# Altium schematic sheet Voltage_sensor.SchDoc
size B; SheetNumber: 5; SheetTotal: 6; SPICEModelCacheSCQTRBCW: <root> / <DocumentId>SCQTRBCW</DocumentId> / <CacheFrame Number="0"> / <Model Name="cap" Kind="MDL"> / <Text>*Default semiconductor capacitor / .MODEL CAP C()</Text> / </Model> / <Model Name="zener" Kind="MDL"> / <Text>*ZENER / *Default Zener 10V @ 10mA / *Zener Diode Pinout: A,K / .MODEL ZENER D( BV=10 IBV=10E-3 )</Text> / </Model> / </CacheFrame> / </root>
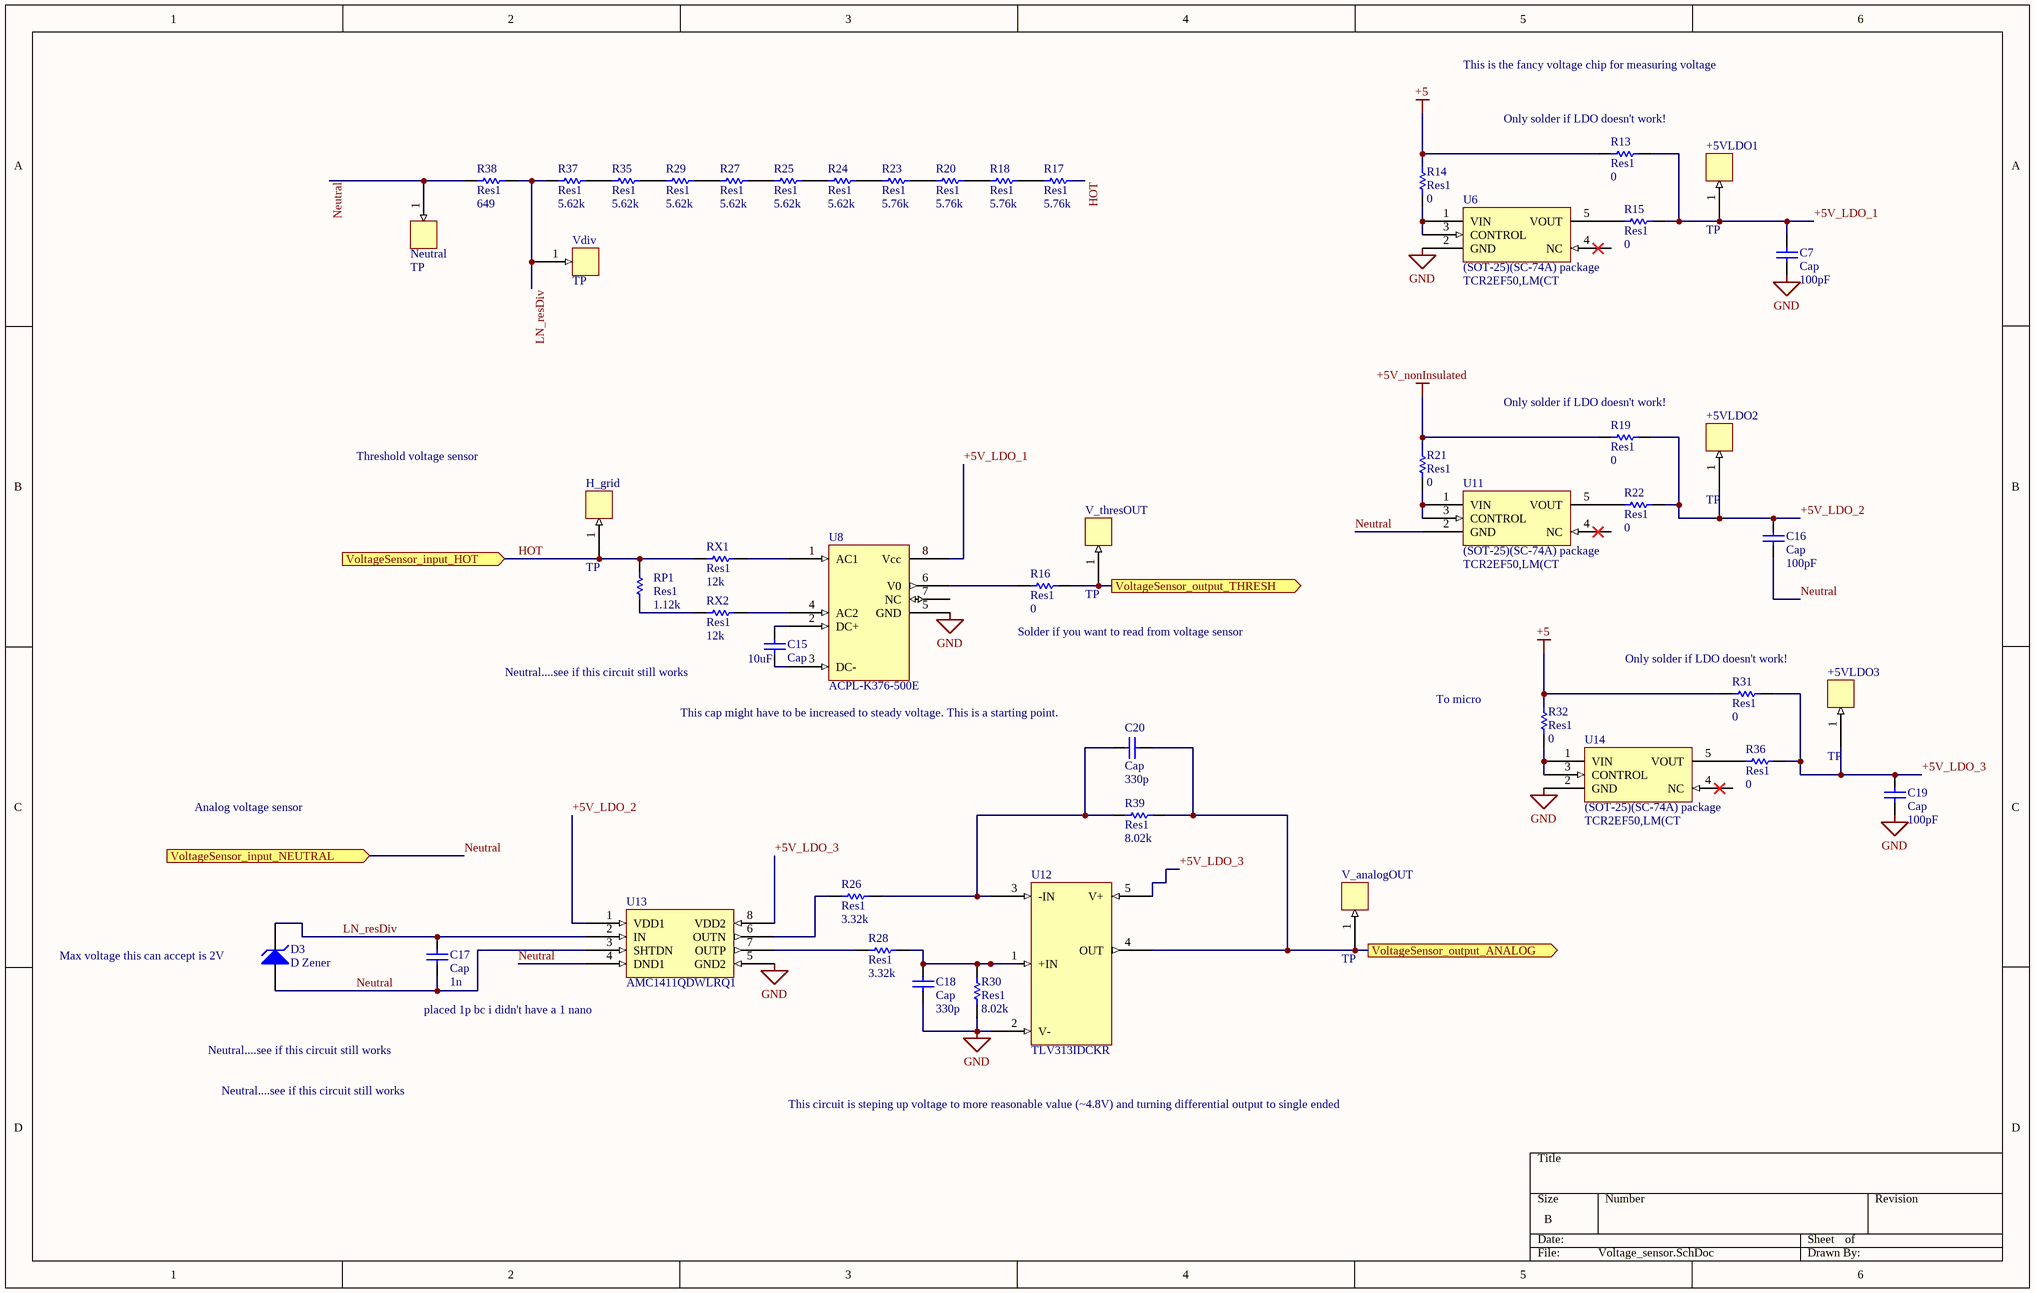
[diagram p0: Voltage_sensor.SchDoc]

## Parts
+5VLDO1  TP  [TP]
+5VLDO2  TP  [TP]
+5VLDO3  TP  [TP]
C7  Cap  value 100pF  [0603]
C15  Cap  value 10uF  [0603]
C16  Cap  value 100pF  [0603]
C17  Cap  value 1n  [0603]
C18  Cap  value 330p  [0603]
C19  Cap  value 100pF  [0603]
C20  Cap  value 330p  [0603]
D3  D Zener  [SOT23_N]
H_grid  TP  [TP]
Neutral  TP  [TP]
R13  Res1  value 0  [0603]
R14  Res1  value 0  [0603]
R15  Res1  value 0  [0603]
R16  Res1  value 0  [0603]
R17  Res1  value 5.76k  [0603]
R18  Res1  value 5.76k  [0603]
R19  Res1  value 0  [0603]
R20  Res1  value 5.76k  [0603]
R21  Res1  value 0  [0603]
R22  Res1  value 0  [0603]
R23  Res1  value 5.76k  [0603]
R24  Res1  value 5.62k  [0603]
R25  Res1  value 5.62k  [0603]
R26  Res1  value 3.32k  [0603]
R27  Res1  value 5.62k  [0603]
R28  Res1  value 3.32k  [0603]
R29  Res1  value 5.62k  [0603]
R30  Res1  value 8.02k  [0603]
R31  Res1  value 0  [0603]
R32  Res1  value 0  [0603]
R35  Res1  value 5.62k  [0603]
R36  Res1  value 0  [0603]
R37  Res1  value 5.62k  [0603]
R38  Res1  value 649  [0603]
R39  Res1  value 8.02k  [0603]
RP1  Res1  value 1.12k  [0603]
RX1  Res1  value 12k  [0603]
RX2  Res1  value 12k  [0603]
U6  TCR2EF50,LM(CT  [SOT95P275X130-5N]
U8  ACPL-K376-500E  [ACPL-K376-500E]
U11  TCR2EF50,LM(CT  [SOT95P275X130-5N]
U12  TLV313IDCKR  [TLV313IDCKR]
U13  AMC1411QDWLRQ1  [AMC1411QDWLRQ1]
U14  TCR2EF50,LM(CT  [SOT95P275X130-5N]
V_analogOUT  TP  [TP]
V_thresOUT  TP  [TP]
Vdiv  TP  [TP]

## Ports
VoltageSensor_input_HOT (in), VoltageSensor_input_NEUTRAL (in), VoltageSensor_output_ANALOG (out), VoltageSensor_output_THRESH (out)

## Nets
+5: R13.2 R14.1 R31.2 R32.1
+5V_nonInsulated: R19.2 R21.1
GND: C7.1 C18.2 C19.1 R30.1 U6.2(GND) U8.5(GND) U12.2(V-) U13.5(GND2) U14.2(GND)
+5V_LDO_1: +5VLDO1.1 C7.2 R13.1 R15.1 U8.8(Vcc)
+5V_LDO_2: +5VLDO2.1 C16.2 R19.1 R22.1 U13.1(VDD1)
+5V_LDO_3: +5VLDO3.1 C19.2 R31.1 R36.1 U12.5(V+) U13.8(VDD2)
HOT: H_grid.1 R17.1 RP1.2 RX1.2 ; port VoltageSensor_input_HOT
LN_resDiv: C17.2 D3.2(K) R37.2 R38.1 U13.2(IN) Vdiv.1
Neutral: C16.1 C17.1 D3.1(A) Neutral.1 R38.2 U11.2(GND) U13.3(SHTDN) U13.4(DND1) ; port VoltageSensor_input_NEUTRAL
VoltageSensor_output_ANALOG: C20.2 R39.2 U12.4(OUT) V_analogOUT.1 ; port VoltageSensor_output_ANALOG
VoltageSensor_output_THRESH: R16.1 V_thresOUT.1 ; port VoltageSensor_output_THRESH
NetC15_1: C15.1 U8.3(DC-)
NetC15_2: C15.2 U8.2(DC+)
NetC18_1: C18.1 R28.2 R30.2 U12.1(+IN)
NetC20_1: C20.1 R26.2 R39.1 U12.3(-IN)
NetR14_2: R14.2 U6.1(VIN) U6.3(CONTROL)
NetR15_2: R15.2 U6.5(VOUT)
NetR16_2: R16.2 U8.6(V0)
NetR17_2: R17.2 R18.2
NetR18_1: R18.1 R20.1
NetR20_2: R20.2 R23.1
NetR21_2: R21.2 U11.1(VIN) U11.3(CONTROL)
NetR22_2: R22.2 U11.5(VOUT)
NetR23_2: R23.2 R24.1
NetR24_2: R24.2 R25.1
NetR25_2: R25.2 R27.1
NetR26_1: R26.1 U13.6(OUTN)
NetR27_2: R27.2 R29.1
NetR28_1: R28.1 U13.7(OUTP)
NetR29_2: R29.2 R35.1
NetR32_2: R32.2 U14.1(VIN) U14.3(CONTROL)
NetR35_2: R35.2 R37.1
NetR36_2: R36.2 U14.5(VOUT)
NetRP1_1: RP1.1 RX2.2
NetRX1_1: RX1.1 U8.1(AC1)
NetRX2_1: RX2.1 U8.4(AC2)

Not connected (* = marked no-connect by the designer): U6 4(NC); U8 7(NC); U11 4(NC); U14 4(NC)

## Notes on the sheet
- This is the fancy voltage chip for measuring voltage
- (near R13) Only solder if LDO doesn't work!
- (near R19) Only solder if LDO doesn't work!
- Threshold voltage sensor
- (near R16) Solder if you want to read from voltage sensor
- (near C15) Neutral....see if this circuit still works
- To micro
- (near R31) Only solder if LDO doesn't work!
- This cap might have to be increased to steady voltage. This is a starting point.
- Analog voltage sensor
- (near D3) Max voltage this can accept is 2V
- placed 1p bc i didn't have a 1 nano
- Neutral....see if this circuit still works
- This circuit is steping up voltage to more reasonable value (~4.8V) and turning differential output to single ended
- (in symbol TCR2EF50,LM(CT) (SOT-25)(SC-74A) package

## Library data of the parts
C7 C15-C20 = Cap: Capacitor; Published: 8-Jun-2000; LatestRevisionDate: 17-Jul-2002; LatestRevisionNote: Re-released for DXP Platform.; PackageReference: RAD-0.3; Publisher: Altium Limited; PackageDescription: Radial Cap, Thru-Hole; 2 Leads; 0.3 in Pin Spacing
D3 = D Zener: https://www.mouser.com/ProductDetail/Taiwan-Semiconductor/TSZU52C4V7-RGG?qs=5aG0NVq1C4yA6BT7gqMcyA%3D%3D; Published: 8-Jun-2000; LatestRevisionDate: 17-Jul-2002; LatestRevisionNote: Re-released for DXP Platform.; PackageReference: DIODE-0.7; Publisher: Altium Limited; PackageDescription: Diode, Thru-Hole; 2 Leads; 0.7 in Pin Spacing; ComponentLink1Description: New link; ComponentLink1URL: *; ComponentLink2Description: New link 1; ComponentLink2URL: *
R13-R32 R35-R39 RP1 RX1 RX2 = Res1: Resistor; Published: 8-Jun-2000; LatestRevisionDate: 17-Jul-2002; LatestRevisionNote: Re-released for DXP Platform.; PackageReference: AXIAL-0.3; Publisher: Altium Limited; PackageDescription: Axial Device, Thru-Hole; 2 Leads; 0.3 in Pin Spacing
U12 = TLV313IDCKR: https://www.mouser.com/ProductDetail/Texas-Instruments/TLV313IDCKR?qs=8%252Br4Hz5Xir8P1rgivePgtw%3D%3D; ComponentLink1Description: digikey; ComponentLink1URL: https://www.mouser.com/ProductDetail/Texas-Instruments/TLV313IDCKR?qs=8%252Br4Hz5Xir8P1rgivePgtw%3D%3D; ComponentLink2Description: New link; ComponentLink2URL: *; ComponentLink3Description: New link 1; ComponentLink3URL: *
U13 = AMC1411QDWLRQ1: mouser: https://www.mouser.com/ProductDetail/Texas-Instruments/AMC1411QDWLRQ1?qs=Rp5uXu7WBW9VgWcI1l5sjg%3D%3D; ComponentLink1Description: New link; ComponentLink1URL: *; ComponentLink2Description: New link 1; ComponentLink2URL: *